# EAGLE schematic MOMO_2019 (EAGLE 7.3.0)

## Sheet 1 of 6
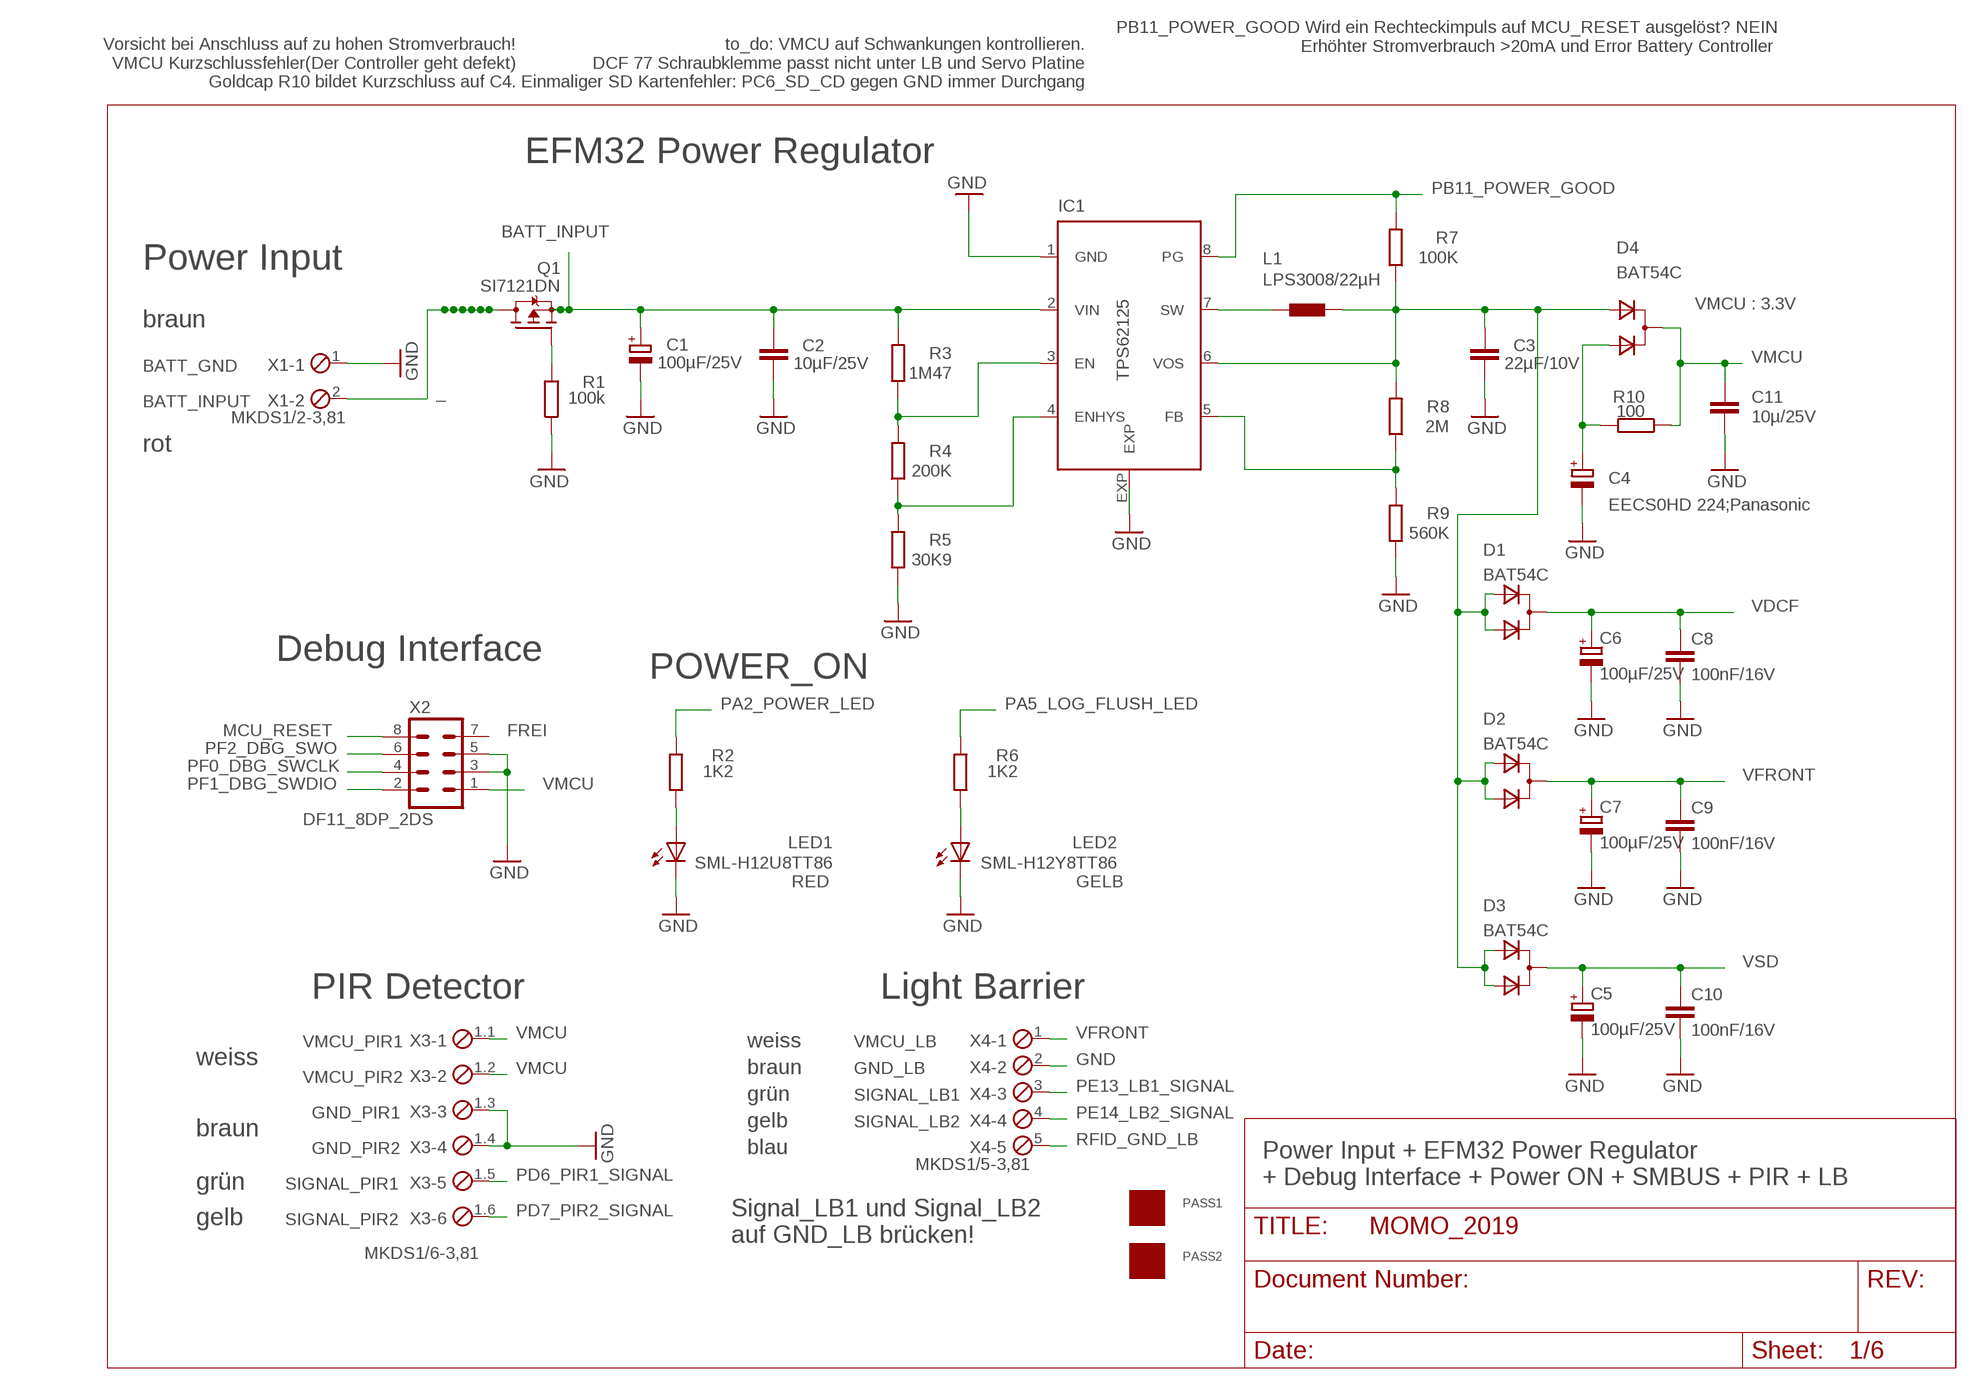
[diagram p0: schematic, sheet 1]

### Parts
C1  100µF/25V  CPOL-EUE  [PANASONIC_E]
C2  10µF/25V  C-EUC1206  [C1206]
C3  22µF/10V  C-EUC0603  [C0603]
C4  EECS0HD 224;Panasonic  GOLDCAPSPK-V  [GOLDCAPSPK-V]
C5  100µF/25V  CPOL-EUE  [PANASONIC_E]
C6  100µF/25V  CPOL-EUE  [PANASONIC_E]
C7  100µF/25V  CPOL-EUE  [PANASONIC_E]
C8  100nF/16V  C-EUC0805  [C0805]
C9  100nF/16V  C-EUC0805  [C0805]
C10  100nF/16V  C-EUC0805  [C0805]
C11  10µ/25V  C-EUC1206  [C1206]
D1  BAT54C  D2A_SOT23  [SOT-23$1]
D2  BAT54C  D2A_SOT23  [SOT-23$1]
D3  BAT54C  D2A_SOT23  [SOT-23$1]
D4  BAT54C  D2A_SOT23  [SOT-23$1]
IC1  TPS62125  [DSG_PWSO-N8_EXP]
L1  LPS3008/22µH  LPS3008  [LPS3008]
LED1  SML-H12U8TT86  LEDCHIPLED_0805  [CHIPLED_0805]
LED2  SML-H12Y8TT86  LEDCHIPLED_0805  [CHIPLED_0805]
PASS1  ROUND_1MM1.5  [ROUND2_1.5MM]
PASS2  ROUND_1MM1.5  [ROUND2_1.5MM]
Q1  SI7121DN  TRANSISTOR-FET_SI7113DN  [TRANSISTOR-FET_1212-8S]
R1  100k  R-EU_R0805  [R0805]
R2  1K2  R-EU_R0805  [R0805]
R3  1M47  R-EU_R0805  [R0805]
R4  200K  R-EU_R0805  [R0805]
R5  30K9  R-EU_R0805  [R0805]
R6  1K2  R-EU_R0805  [R0805]
R7  100K  R-EU_R0805  [R0805]
R8  2M  R-EU_R0805  [R0805]
R9  560K  R-EU_R0805  [R0805]
R10  100  R-EU_R0805  [R0805]
X1  MKDS1/2-3,81  [2POL381]
X2  DF11_8DP_2DS  DP11_8DP_2DS  [DP11_8DP-2DS]
X3  MKDS1/6-3,81  [6POL381]
X4  MKDS1/5-3,81  [5POL381]

### Nets
1: C3.1 D1.2(A1) D1.3(A2) D2.2(A1) D2.3(A2) D3.2(A1) D3.3(A2) D4.2(A1) IC1.6(VOS) L1.2 R7.1 R8.2
_: Q1.5(D) Q1.6(D) Q1.7(D) Q1.8(D) Q1.9(D) Q1.10(D) Q1.11(D) X1.2
BATT_INPUT: C1.+ C2.1 IC1.2(VIN) Q1.1(S) Q1.2(S) Q1.3(S) R3.2 ; also sheet 5,6
GND: C1.- C2.2 C3.2 C4.- C5.- C6.- C7.- C8.2 C9.2 C10.2 C11.1 IC1.1(GND) IC1.EXP LED1.C LED2.C R1.1 R5.1 R9.1 X1.1 X2.3 X2.5 X3.1.3 X3.1.4 X4.2 ; also sheet 2,3,4,5,6
MCU_RESET: X2.8 ; also sheet 2,3
N$2: LED2.A R6.2
N$3: C4.+ D4.3(A2) R10.2
N$5: IC1.3(EN) R3.1 R4.2
N$8: IC1.4(ENHYS) R4.1 R5.2
N$9: IC1.7(SW) L1.1
N$20: Q1.4(G) R1.2
N$29: LED1.A R2.2
N$46: IC1.5(FB) R8.1 R9.2
PA2_POWER_LED: R2.1 ; also sheet 2
PA5_LOG_FLUSH_LED: R6.1 ; also sheet 2
PB11_POWER_GOOD: IC1.8(PG) R7.2 ; also sheet 2
PD6_PIR1_SIGNAL: X3.1.5 ; also sheet 2
PD7_PIR2_SIGNAL: X3.1.6 ; also sheet 2
PE13_LB1_SIGNAL: X4.3 ; also sheet 2
PE14_LB2_SIGNAL: X4.4 ; also sheet 2
PF0_DBG_SWCLK: X2.4 ; also sheet 2
PF1_DBG_SWDIO: X2.2 ; also sheet 2
PF2_DBG_SWO: X2.6 ; also sheet 2
RFID_GND_LB: X4.5 ; also sheet 4
VDCF: C6.+ C8.1 D1.1(C) ; also sheet 3
VFRONT: C7.+ C9.1 D2.1(C) X4.1
VMCU: C11.2 D4.1(C) R10.1 X2.1 X3.1.1 X3.1.2 ; also sheet 2,3,4
VSD: C5.+ C10.1 D3.1(C) ; also sheet 3
Unconnected: X2.7

### Notes on the sheet
- PB11_POWER_GOOD Wird ein Rechteckimpuls auf MCU_RESET ausgelöst? NEIN
  Erhöhter Stromverbrauch >20mA und Error Battery Controller
- Vorsicht bei Anschluss auf zu hohen Stromverbrauch!
  VMCU Kurzschlussfehler(Der Controller geht defekt)
  Goldcap R10 bildet Kurzschluss auf C4.
- to_do: VMCU auf Schwankungen kontrollieren.
  DCF 77 Schraubklemme passt nicht unter LB und Servo Platine
  Einmaliger SD Kartenfehler: PC6_SD_CD gegen GND immer Durchgang
- EFM32 Power Regulator
- Power Input
- VMCU : 3.3V
- braun
- BATT_GND
- BATT_INPUT
- rot
- Debug Interface
- POWER_ON
- FREI
- RED | GELB
- PIR Detector | Light Barrier
- VMCU_PIR1 | weiss | VMCU_LB
- weiss
- braun | GND_LB
- VMCU_PIR2
- grün | SIGNAL_LB1
- GND_PIR1
- gelb | SIGNAL_LB2
- braun
- GND_PIR2 | blau
- Power Input + EFM32 Power Regulator 
  + Debug Interface + Power ON + SMBUS + PIR + LB
- grün | SIGNAL_PIR1
- gelb | SIGNAL_PIR2
- Signal_LB1 und Signal_LB2
  auf GND_LB brücken!

## Sheet 2 of 6
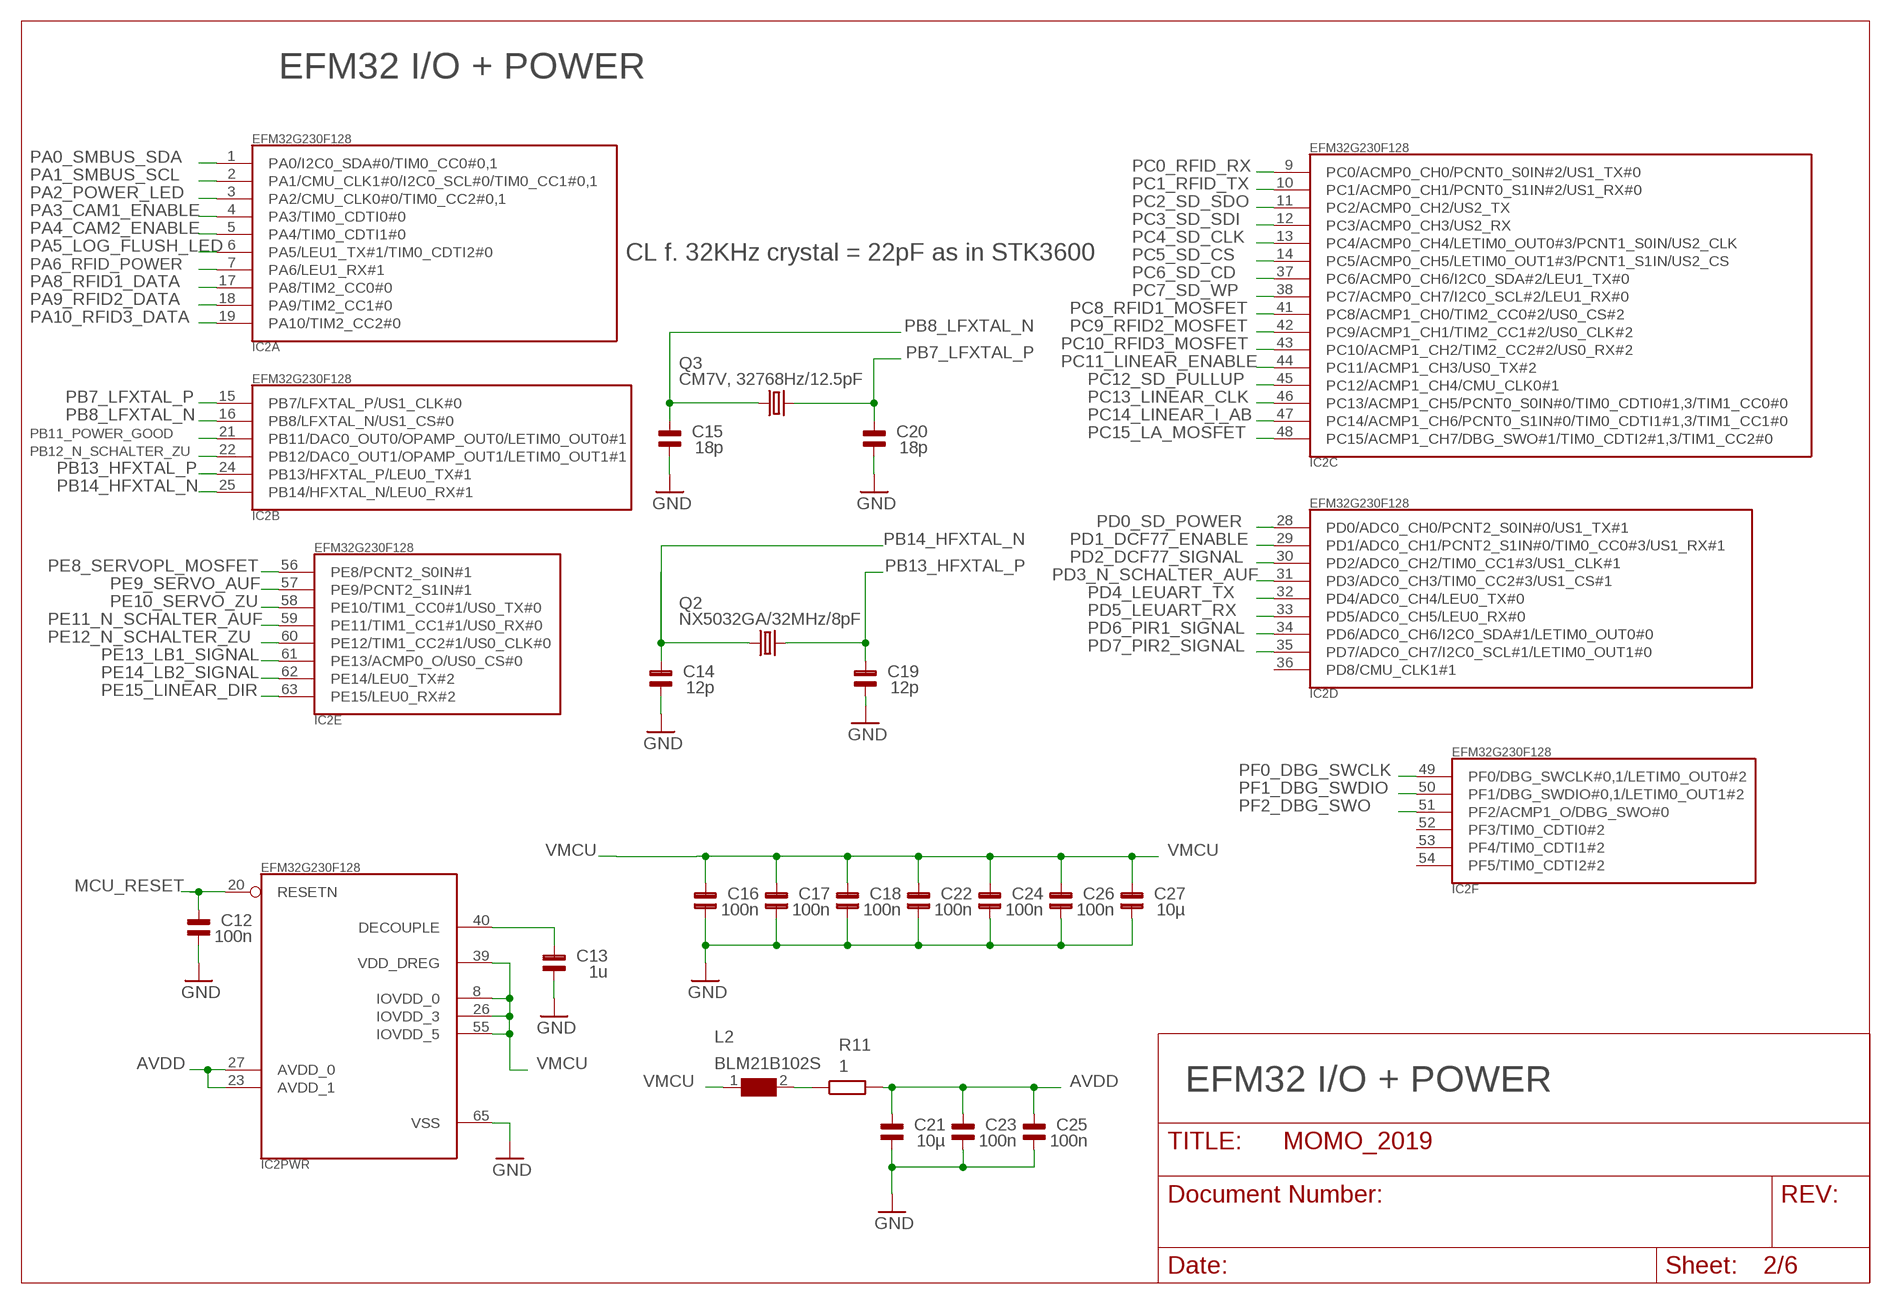
[diagram p1: schematic, sheet 2]

### Parts
C12  100n  C_SMD0805  [0805]
C13  1u  C_SMD0805  [0805]
C14  12p  C_SMD0805  [0805]
C15  18p  C_SMD0805  [0805]
C16  100n  C_SMD0805  [0805]
C17  100n  C_SMD0805  [0805]
C18  100n  C_SMD0805  [0805]
C19  12p  C_SMD0805  [0805]
C20  18p  C_SMD0805  [0805]
C21  10µ  C_SMD0805  [0805]
C22  100n  C_SMD0805  [0805]
C23  100n  C_SMD0805  [0805]
C24  100n  C_SMD0805  [0805]
C25  100n  C_SMD0805  [0805]
C26  100n  C_SMD0805  [0805]
C27  10µ  C_SMD0805  [0805]
IC2  EFM32G230F128  [QFN64]
L2  BLM21B102S  WE-CBF-7427920_0805  [0805]
Q2  NX5032GA/32MHz/8pF  CRYSTAL2P5.0X3.2  [CRYSTAL2P5.0X3.2]
Q3  CM7V, 32768Hz/12.5pF  CRYSTAL2P  [CRYSTAL2P3.2X1.5]
R11  1  R-EU_R0805  [R0805]

### Nets
AVDD [VCC]: C21.2 C23.2 C25.2 IC2.23(PWR:AVDD_1) IC2.27(PWR:AVDD_0) R11.2
GND: C12.1 C13.1 C14.1 C15.1 C16.1 C17.1 C18.1 C19.1 C20.1 C21.1 C22.1 C23.1 C24.1 C25.1 C26.1 C27.1 IC2.65(PWR:VSS) ; also sheet 1,3,4,5,6
MCU_RESET: C12.2 IC2.20(PWR:RESETN) ; also sheet 1,3
N$14: L2.2 R11.1
N$30: C13.2 IC2.40(PWR:DECOUPLE)
PA0_SMBUS_SDA: IC2.1(A:PA0/I2C0_SDA#0/TIM0_CC0#0,1) ; also sheet 3
PA1_SMBUS_SCL: IC2.2(A:PA1/CMU_CLK1#0/I2C0_SCL#0/TIM0_CC1#0,1) ; also sheet 3
PA2_POWER_LED: IC2.3(A:PA2/CMU_CLK0#0/TIM0_CC2#0,1) ; also sheet 1
PA3_CAM1_ENABLE: IC2.4(A:PA3/TIM0_CDTI0#0) ; also sheet 5
PA4_CAM2_ENABLE: IC2.5(A:PA4/TIM0_CDTI1#0) ; also sheet 5
PA5_LOG_FLUSH_LED: IC2.6(A:PA5/LEU1_TX#1/TIM0_CDTI2#0) ; also sheet 1
PA6_RFID_POWER: IC2.7(A:PA6/LEU1_RX#1) ; also sheet 4
PA8_RFID1_DATA: IC2.17(A:PA8/TIM2_CC0#0) ; also sheet 4
PA9_RFID2_DATA: IC2.18(A:PA9/TIM2_CC1#0) ; also sheet 4
PA10_RFID3_DATA: IC2.19(A:PA10/TIM2_CC2#0) ; also sheet 4
PB7_LFXTAL_P: C20.2 IC2.15(B:PB7/LFXTAL_P/US1_CLK#0) Q3.2
PB8_LFXTAL_N: C15.2 IC2.16(B:PB8/LFXTAL_N/US1_CS#0) Q3.1
PB11_POWER_GOOD: IC2.21(B:PB11/DAC0_OUT0/OPAMP_OUT0/LETIM0_OUT0#1) ; also sheet 1
PB12_N_SCHALTER_ZU: IC2.22(B:PB12/DAC0_OUT1/OPAMP_OUT1/LETIM0_OUT1#1) ; also sheet 6
PB13_HFXTAL_P: C19.2 IC2.24(B:PB13/HFXTAL_P/LEU0_TX#1) Q2.2
PB14_HFXTAL_N: C14.2 IC2.25(B:PB14/HFXTAL_N/LEU0_RX#1) Q2.1
PC0_RFID_RX: IC2.9(C:PC0/ACMP0_CH0/PCNT0_S0IN#2/US1_TX#0) ; also sheet 4
PC1_RFID_TX: IC2.10(C:PC1/ACMP0_CH1/PCNT0_S1IN#2/US1_RX#0) ; also sheet 4
PC2_SD_SDO: IC2.11(C:PC2/ACMP0_CH2/US2_TX) ; also sheet 3
PC3_SD_SDI: IC2.12(C:PC3/ACMP0_CH3/US2_RX) ; also sheet 3
PC4_SD_CLK: IC2.13(C:PC4/ACMP0_CH4/LETIM0_OUT0#3/PCNT1_S0IN/US2_CLK) ; also sheet 3
PC5_SD_CS: IC2.14(C:PC5/ACMP0_CH5/LETIM0_OUT1#3/PCNT1_S1IN/US2_CS) ; also sheet 3
PC6_SD_CD: IC2.37(C:PC6/ACMP0_CH6/I2C0_SDA#2/LEU1_TX#0) ; also sheet 3
PC7_SD_WP: IC2.38(C:PC7/ACMP0_CH7/I2C0_SCL#2/LEU1_RX#0) ; also sheet 3
PC8_RFID1_MOSFET: IC2.41(C:PC8/ACMP1_CH0/TIM2_CC0#2/US0_CS#2) ; also sheet 4
PC9_RFID2_MOSFET: IC2.42(C:PC9/ACMP1_CH1/TIM2_CC1#2/US0_CLK#2) ; also sheet 4
PC10_RFID3_MOSFET: IC2.43(C:PC10/ACMP1_CH2/TIM2_CC2#2/US0_RX#2) ; also sheet 4
PC11_LINEAR_ENABLE: IC2.44(C:PC11/ACMP1_CH3/US0_TX#2) ; also sheet 6
PC12_SD_PULLUP: IC2.45(C:PC12/ACMP1_CH4/CMU_CLK0#1) ; also sheet 3
PC13_LINEAR_CLK: IC2.46(C:PC13/ACMP1_CH5/PCNT0_S0IN#0/TIM0_CDTI0#1,3/TIM1_CC0#0) ; also sheet 6
PC14_LINEAR_I_AB: IC2.47(C:PC14/ACMP1_CH6/PCNT0_S1IN#0/TIM0_CDTI1#1,3/TIM1_CC1#0) ; also sheet 6
PC15_LA_MOSFET: IC2.48(C:PC15/ACMP1_CH7/DBG_SWO#1/TIM0_CDTI2#1,3/TIM1_CC2#0) ; also sheet 6
PD0_SD_POWER: IC2.28(D:PD0/ADC0_CH0/PCNT2_S0IN#0/US1_TX#1) ; also sheet 3
PD1_DCF77_ENABLE: IC2.29(D:PD1/ADC0_CH1/PCNT2_S1IN#0/TIM0_CC0#3/US1_RX#1) ; also sheet 3
PD2_DCF77_SIGNAL: IC2.30(D:PD2/ADC0_CH2/TIM0_CC1#3/US1_CLK#1) ; also sheet 3
PD3_N_SCHALTER_AUF: IC2.31(D:PD3/ADC0_CH3/TIM0_CC2#3/US1_CS#1) ; also sheet 6
PD4_LEUART_TX: IC2.32(D:PD4/ADC0_CH4/LEU0_TX#0) ; also sheet 3
PD5_LEUART_RX: IC2.33(D:PD5/ADC0_CH5/LEU0_RX#0) ; also sheet 3
PD6_PIR1_SIGNAL: IC2.34(D:PD6/ADC0_CH6/I2C0_SDA#1/LETIM0_OUT0#0) ; also sheet 1
PD7_PIR2_SIGNAL: IC2.35(D:PD7/ADC0_CH7/I2C0_SCL#1/LETIM0_OUT1#0) ; also sheet 1
PE8_SERVOPL_MOSFET: IC2.56(E:PE8/PCNT2_S0IN#1) ; also sheet 6
PE9_SERVO_AUF: IC2.57(E:PE9/PCNT2_S1IN#1) ; also sheet 6
PE10_SERVO_ZU: IC2.58(E:PE10/TIM1_CC0#1/US0_TX#0) ; also sheet 6
PE11_N_SCHALTER_AUF: IC2.59(E:PE11/TIM1_CC1#1/US0_RX#0) ; also sheet 6
PE12_N_SCHALTER_ZU: IC2.60(E:PE12/TIM1_CC2#1/US0_CLK#0) ; also sheet 6
PE13_LB1_SIGNAL: IC2.61(E:PE13/ACMP0_O/US0_CS#0) ; also sheet 1
PE14_LB2_SIGNAL: IC2.62(E:PE14/LEU0_TX#2) ; also sheet 1
PE15_LINEAR_DIR: IC2.63(E:PE15/LEU0_RX#2) ; also sheet 6
PF0_DBG_SWCLK: IC2.49(F:PF0/DBG_SWCLK#0,1/LETIM0_OUT0#2) ; also sheet 1
PF1_DBG_SWDIO: IC2.50(F:PF1/DBG_SWDIO#0,1/LETIM0_OUT1#2) ; also sheet 1
PF2_DBG_SWO: IC2.51(F:PF2/ACMP1_O/DBG_SWO#0) ; also sheet 1
VMCU: C16.2 C17.2 C18.2 C22.2 C24.2 C26.2 C27.2 IC2.8(PWR:IOVDD_0) IC2.26(PWR:IOVDD_3) IC2.39(PWR:VDD_DREG) IC2.55(PWR:IOVDD_5) L2.1 ; also sheet 1,3,4
Unconnected: IC2.36(D:PD8/CMU_CLK1#1) IC2.52(F:PF3/TIM0_CDTI0#2) IC2.53(F:PF4/TIM0_CDTI1#2) IC2.54(F:PF5/TIM0_CDTI2#2)

### Notes on the sheet
- EFM32 I/O + POWER
- CL f. 32KHz crystal = 22pF as in STK3600
- EFM32 I/O + POWER

## Sheet 3 of 6
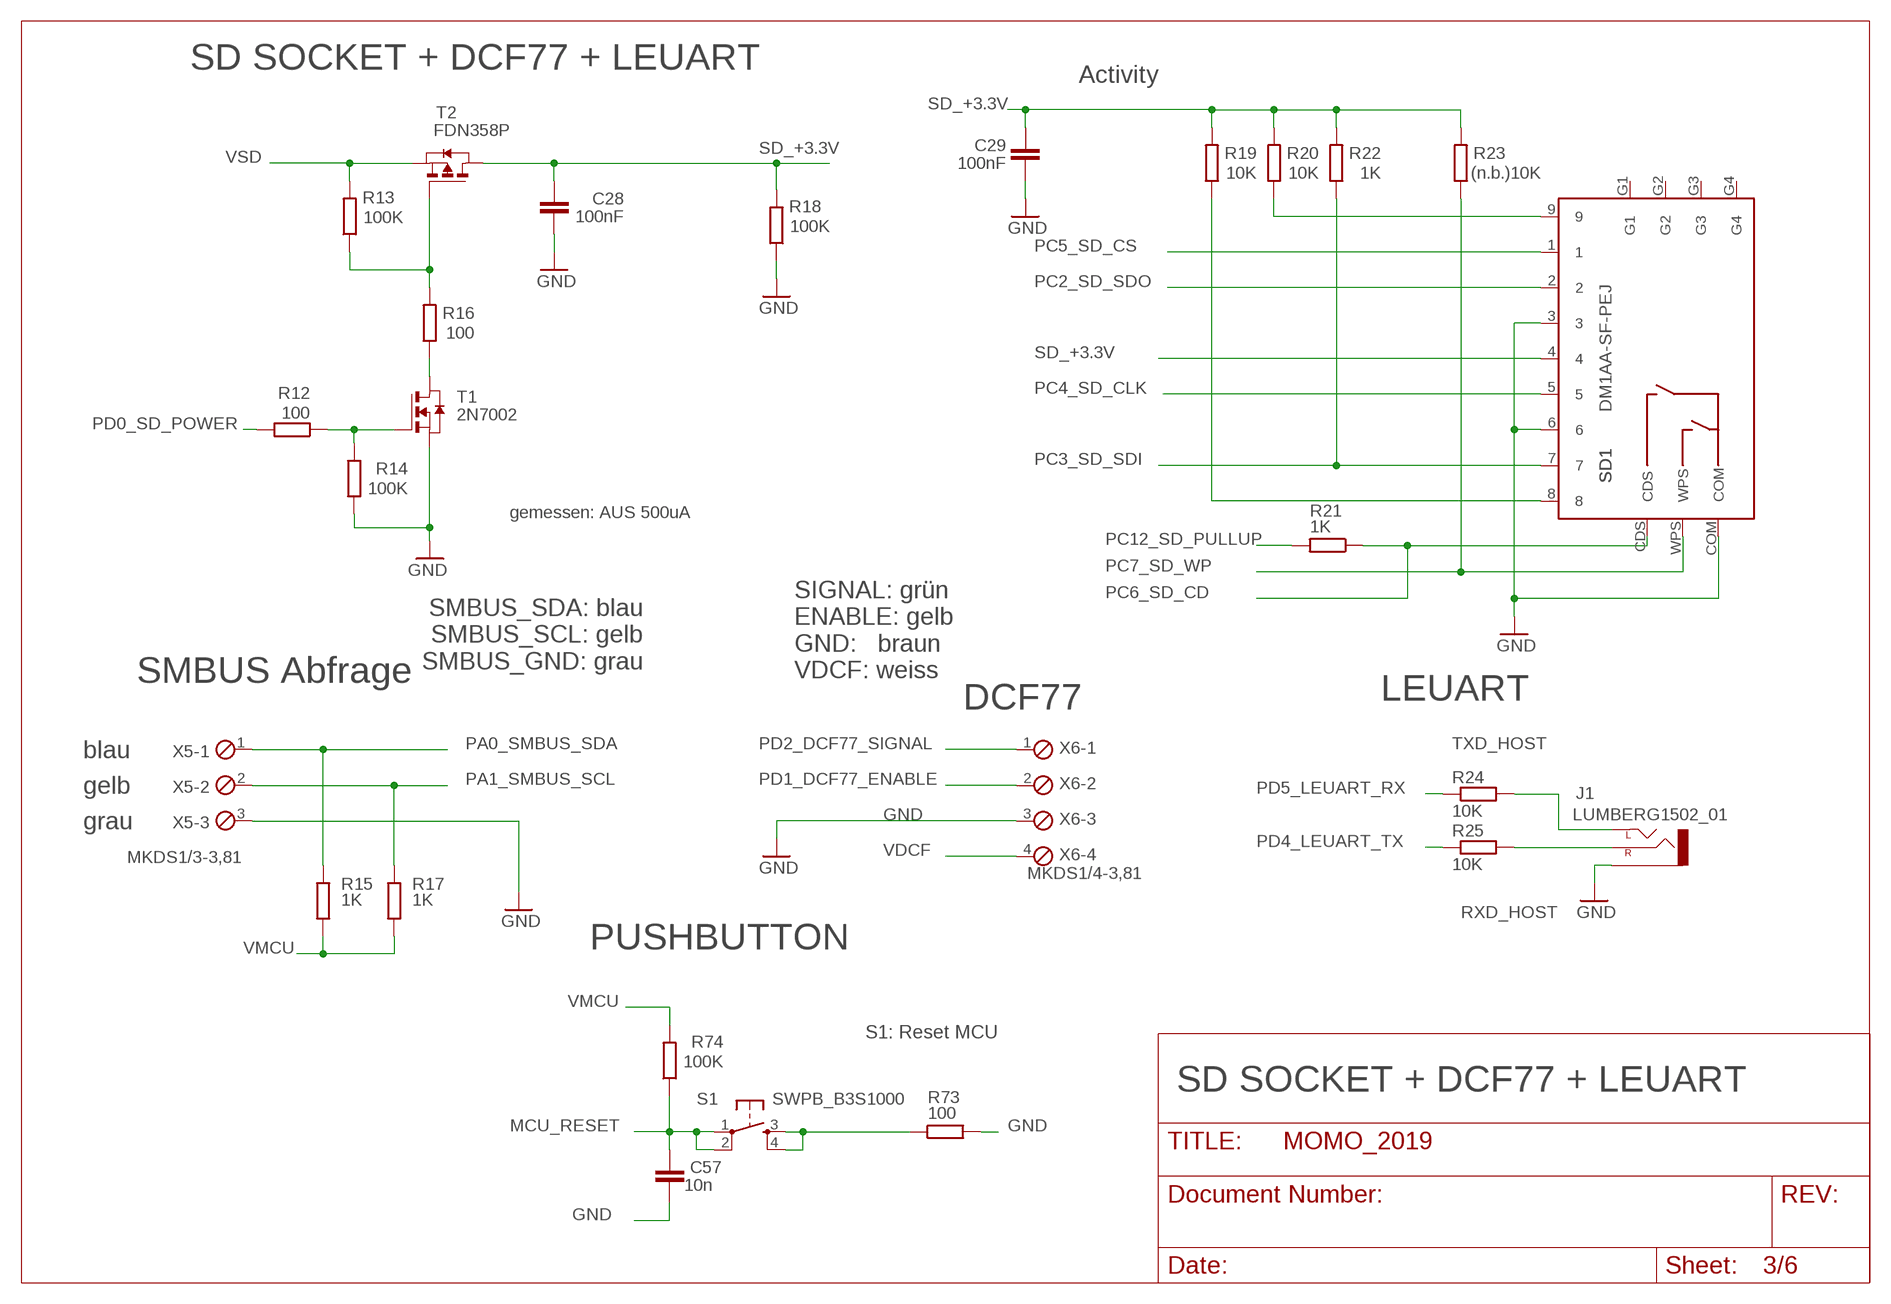
[diagram p2: schematic, sheet 3]

### Parts
C28  100nF  C-EUC0603  [C0603]
C29  100nF  C-EUC0603  [C0603]
C57  10n  C-EUC0603  [C0603]
J1  LUMBERG1502_01  [LUMBERG1502_01]
R12  100  R-EU_R0805  [R0805]
R13  100K  R-EU_R0805  [R0805]
R14  100K  R-EU_R0805  [R0805]
R15  1K  R-EU_R0805  [R0805]
R16  100  R-EU_R0805  [R0805]
R17  1K  R-EU_R0805  [R0805]
R18  100K  R-EU_R0805  [R0805]
R19  10K  R-EU_R0805  [R0805]
R20  10K  R-EU_R0805  [R0805]
R21  1K  R-EU_R0805  [R0805]
R22  1K  R-EU_R0805  [R0805]
R23  (n.b.)10K  R-EU_R0805  [R0805]
R24  10K  R-EU_R0805  [R0805]
R25  10K  R-EU_R0805  [R0805]
R73  100  R-EU_R0805  [R0805]
R74  100K  R-EU_R0805  [R0805]
S1  SWPB_B3S1000  DTSM-6  [DTSM-6]
SD1  DM1AA-SF-PEJ  [DM1AA-SF-PEJ]
T1  2N7002  ZETEX_NMOSSOT23  [ZETEX_SOT-23]
T2  FDN358P  ZETEX_PMOSSOT23  [ZETEX_SOT-23]
X5  MKDS1/3-3,81  [3POL381]
X6  MKDS1/4-3,81  [4POL381]

### Nets
GND: C28.2 C29.2 C57.1 J1.P$1(1-SLEEVE) R14.1 R18.1 R73.2 SD1.3 SD1.6 SD1.COM T1.2(S) X5.3 X6.3 ; also sheet 1,2,4,5,6
MCU_RESET: C57.2 R74.1 S1.1 S1.2 ; also sheet 1,2
N$15: R13.1 R16.2 T2.3(G)
N$16: R16.1 T1.1(D)
N$17: R12.1 R14.2 T1.3(G)
N$21: R20.1 SD1.9
N$22: R19.1 SD1.8
N$43: R73.1 S1.3 S1.4
PA0_SMBUS_SDA: R15.1 X5.1 ; also sheet 2
PA1_SMBUS_SCL: R17.1 X5.2 ; also sheet 2
PC2_SD_SDO: SD1.2 ; also sheet 2
PC3_SD_SDI: R22.1 SD1.7 ; also sheet 2
PC4_SD_CLK: SD1.5 ; also sheet 2
PC5_SD_CS: SD1.1 ; also sheet 2
PC6_SD_CD: R21.1 SD1.CDS ; also sheet 2
PC7_SD_WP: R23.1 SD1.WPS ; also sheet 2
PC12_SD_PULLUP: R21.2 ; also sheet 2
PD0_SD_POWER: R12.2 ; also sheet 2
PD1_DCF77_ENABLE: X6.2 ; also sheet 2
PD2_DCF77_SIGNAL: X6.1 ; also sheet 2
PD4_LEUART_TX: R25.1 ; also sheet 2
PD5_LEUART_RX: R24.1 ; also sheet 2
RXD_HOST: J1.P$3(3-RIGHT) R25.2
SD_+3.3V: C28.1 C29.1 R18.2 R19.2 R20.2 R22.2 R23.2 SD1.4 T2.1(D)
TXD_HOST: J1.P$2(2-LEFT) R24.2
VDCF: X6.4 ; also sheet 1
VMCU: R15.2 R17.2 R74.2 ; also sheet 1,2,4
VSD: R13.2 T2.2(S) ; also sheet 1
Unconnected: SD1.G1 SD1.G2 SD1.G3 SD1.G4

### Notes on the sheet
- SD SOCKET + DCF77 + LEUART
- Activity
- gemessen: AUS 500uA
- SMBUS_SDA: blau
  SMBUS_SCL: gelb
  SMBUS_GND: grau
- SIGNAL: grün
  ENABLE: gelb
  GND:   braun
  VDCF: weiss
- SMBUS Abfrage
- DCF77 | LEUART
- blau
- gelb
- grau
- PUSHBUTTON
- S1: Reset MCU
- SD SOCKET + DCF77 + LEUART

## Sheet 4 of 6
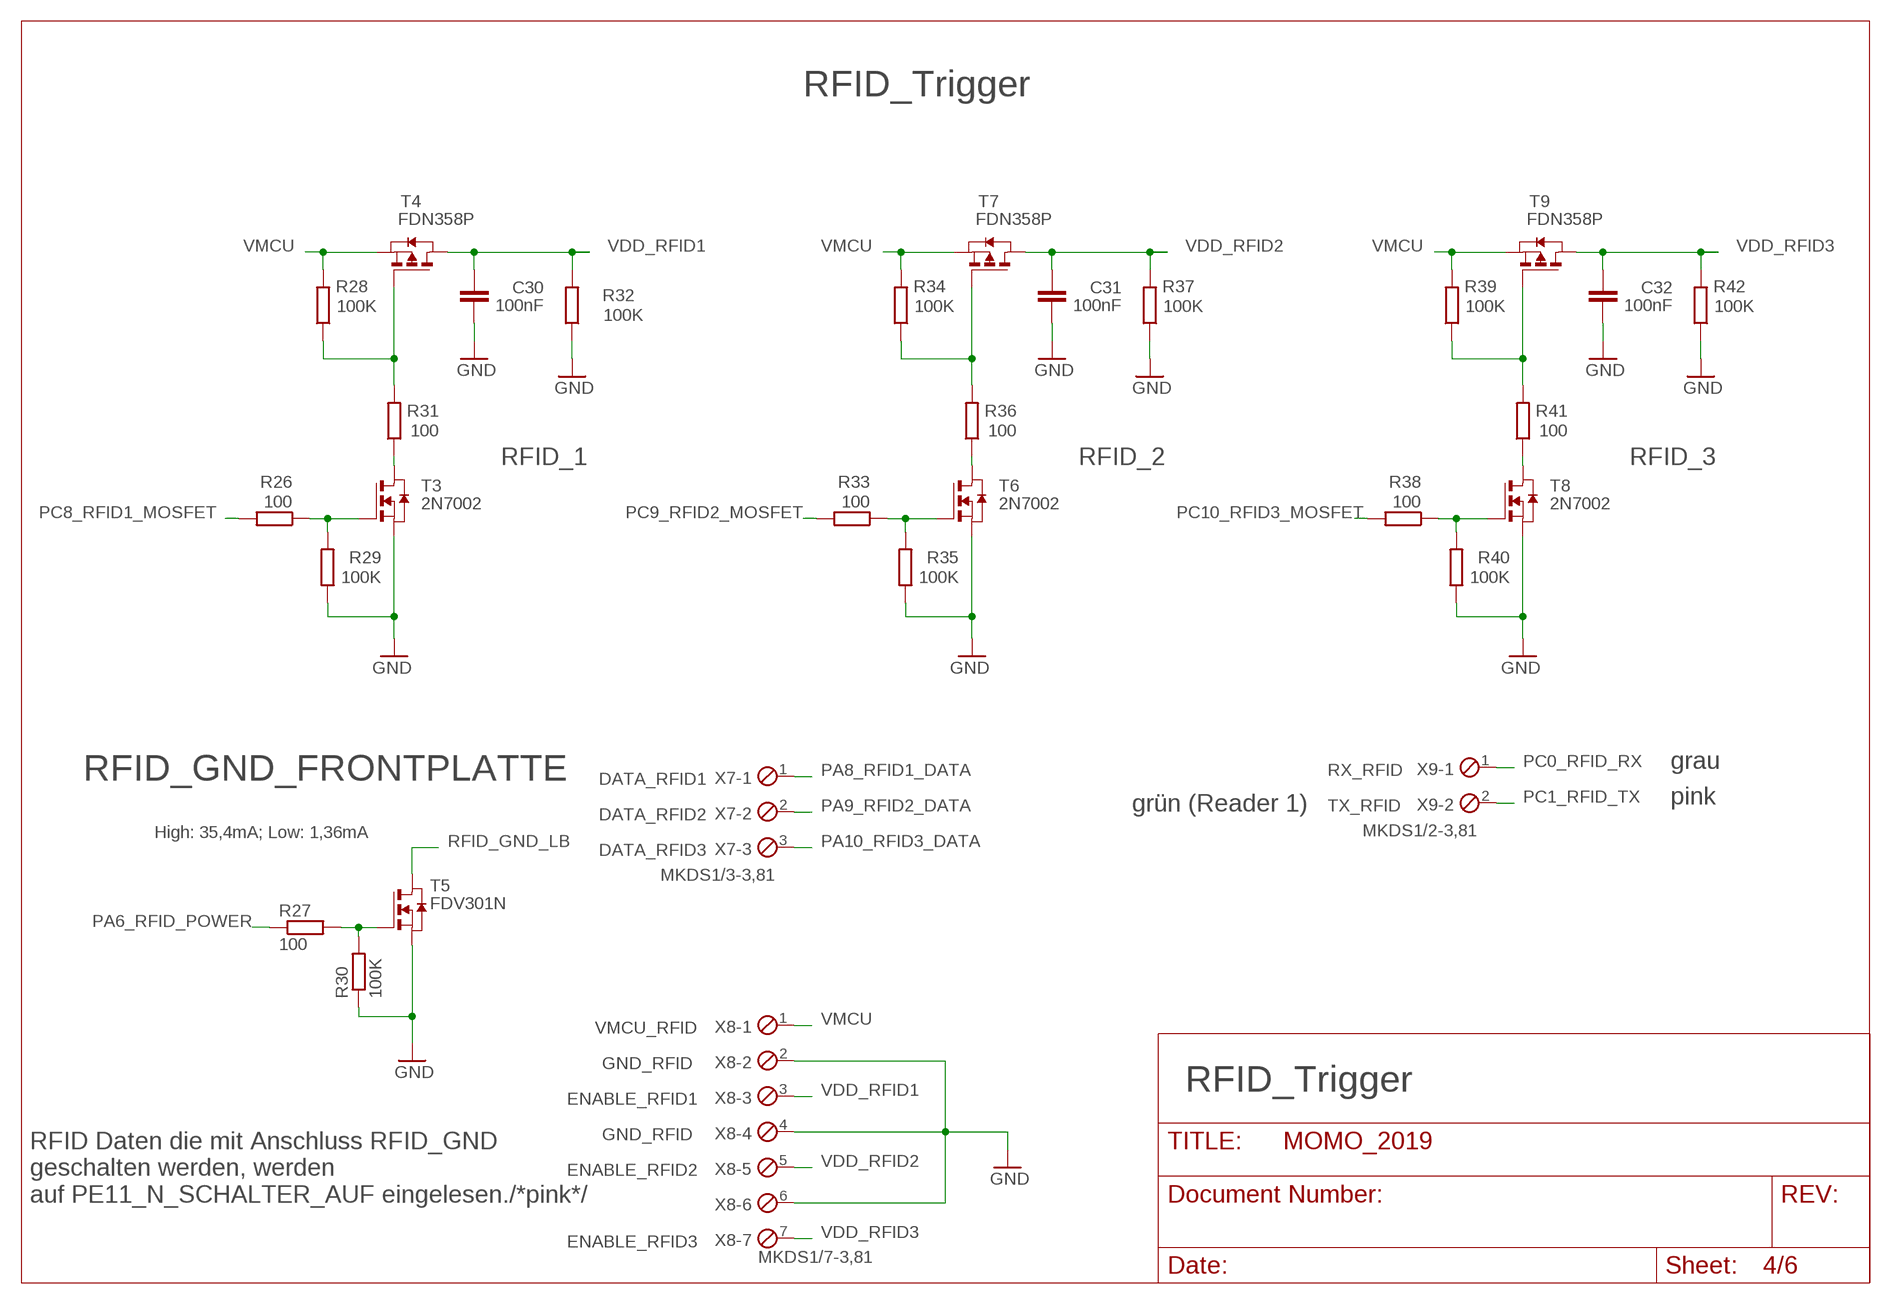
[diagram p3: schematic, sheet 4]

### Parts
C30  100nF  C-EUC0603  [C0603]
C31  100nF  C-EUC0603  [C0603]
C32  100nF  C-EUC0603  [C0603]
R26  100  R-EU_R0805  [R0805]
R27  100  R-EU_R0805  [R0805]
R28  100K  R-EU_R0805  [R0805]
R29  100K  R-EU_R0805  [R0805]
R30  100K  R-EU_R0805  [R0805]
R31  100  R-EU_R0805  [R0805]
R32  100K  R-EU_R0805  [R0805]
R33  100  R-EU_R0805  [R0805]
R34  100K  R-EU_R0805  [R0805]
R35  100K  R-EU_R0805  [R0805]
R36  100  R-EU_R0805  [R0805]
R37  100K  R-EU_R0805  [R0805]
R38  100  R-EU_R0805  [R0805]
R39  100K  R-EU_R0805  [R0805]
R40  100K  R-EU_R0805  [R0805]
R41  100  R-EU_R0805  [R0805]
R42  100K  R-EU_R0805  [R0805]
T3  2N7002  ZETEX_NMOSSOT23  [ZETEX_SOT-23]
T4  FDN358P  ZETEX_PMOSSOT23  [ZETEX_SOT-23]
T5  FDV301N  NMOSSOT23  [SOT-23]
T6  2N7002  ZETEX_NMOSSOT23  [ZETEX_SOT-23]
T7  FDN358P  ZETEX_PMOSSOT23  [ZETEX_SOT-23]
T8  2N7002  ZETEX_NMOSSOT23  [ZETEX_SOT-23]
T9  FDN358P  ZETEX_PMOSSOT23  [ZETEX_SOT-23]
X7  MKDS1/3-3,81  [3POL381]
X8  MKDS1/7-3,81  [7POL381]
X9  MKDS1/2-3,81  [2POL381]

### Nets
GND: C30.2 C31.2 C32.2 R29.1 R30.1 R32.1 R35.1 R37.1 R40.1 R42.1 T3.2(S) T5.2(S) T6.2(S) T8.2(S) X8.2 X8.4 X8.6 ; also sheet 1,2,3,5,6
N$4: R28.1 R31.2 T4.3(G)
N$6: R31.1 T3.1(D)
N$7: R26.1 R29.2 T3.3(G)
N$10: R39.1 R41.2 T9.3(G)
N$11: R41.1 T8.1(D)
N$12: R27.2 R30.2 T5.3(G)
N$13: R38.1 R40.2 T8.3(G)
N$36: R34.1 R36.2 T7.3(G)
N$38: R36.1 T6.1(D)
N$42: R33.1 R35.2 T6.3(G)
PA6_RFID_POWER: R27.1 ; also sheet 2
PA8_RFID1_DATA: X7.1 ; also sheet 2
PA9_RFID2_DATA: X7.2 ; also sheet 2
PA10_RFID3_DATA: X7.3 ; also sheet 2
PC0_RFID_RX: X9.1 ; also sheet 2
PC1_RFID_TX: X9.2 ; also sheet 2
PC8_RFID1_MOSFET: R26.2 ; also sheet 2
PC9_RFID2_MOSFET: R33.2 ; also sheet 2
PC10_RFID3_MOSFET: R38.2 ; also sheet 2
RFID_GND_LB: T5.1(D) ; also sheet 1
VDD_RFID1: C30.1 R32.2 T4.1(D) X8.3
VDD_RFID2: C31.1 R37.2 T7.1(D) X8.5
VDD_RFID3: C32.1 R42.2 T9.1(D) X8.7
VMCU: R28.2 R34.2 R39.2 T4.2(S) T7.2(S) T9.2(S) X8.1 ; also sheet 1,2,3

### Notes on the sheet
- RFID_Trigger
- RFID_1 | RFID_2 | RFID_3
- grau
- RFID_GND_FRONTPLATTE | RX_RFID
- DATA_RFID1
- grün (Reader 1) | pink
- TX_RFID
- DATA_RFID2
- High: 35,4mA; Low: 1,36mA
- DATA_RFID3
- VMCU_RFID
- GND_RFID
- RFID_Trigger
- ENABLE_RFID1
- GND_RFID
- ENABLE_RFID2
- RFID Daten die mit Anschluss RFID_GND 
  geschalten werden, werden
  auf PE11_N_SCHALTER_AUF eingelesen./*pink*/
- ENABLE_RFID3

## Sheet 5 of 6
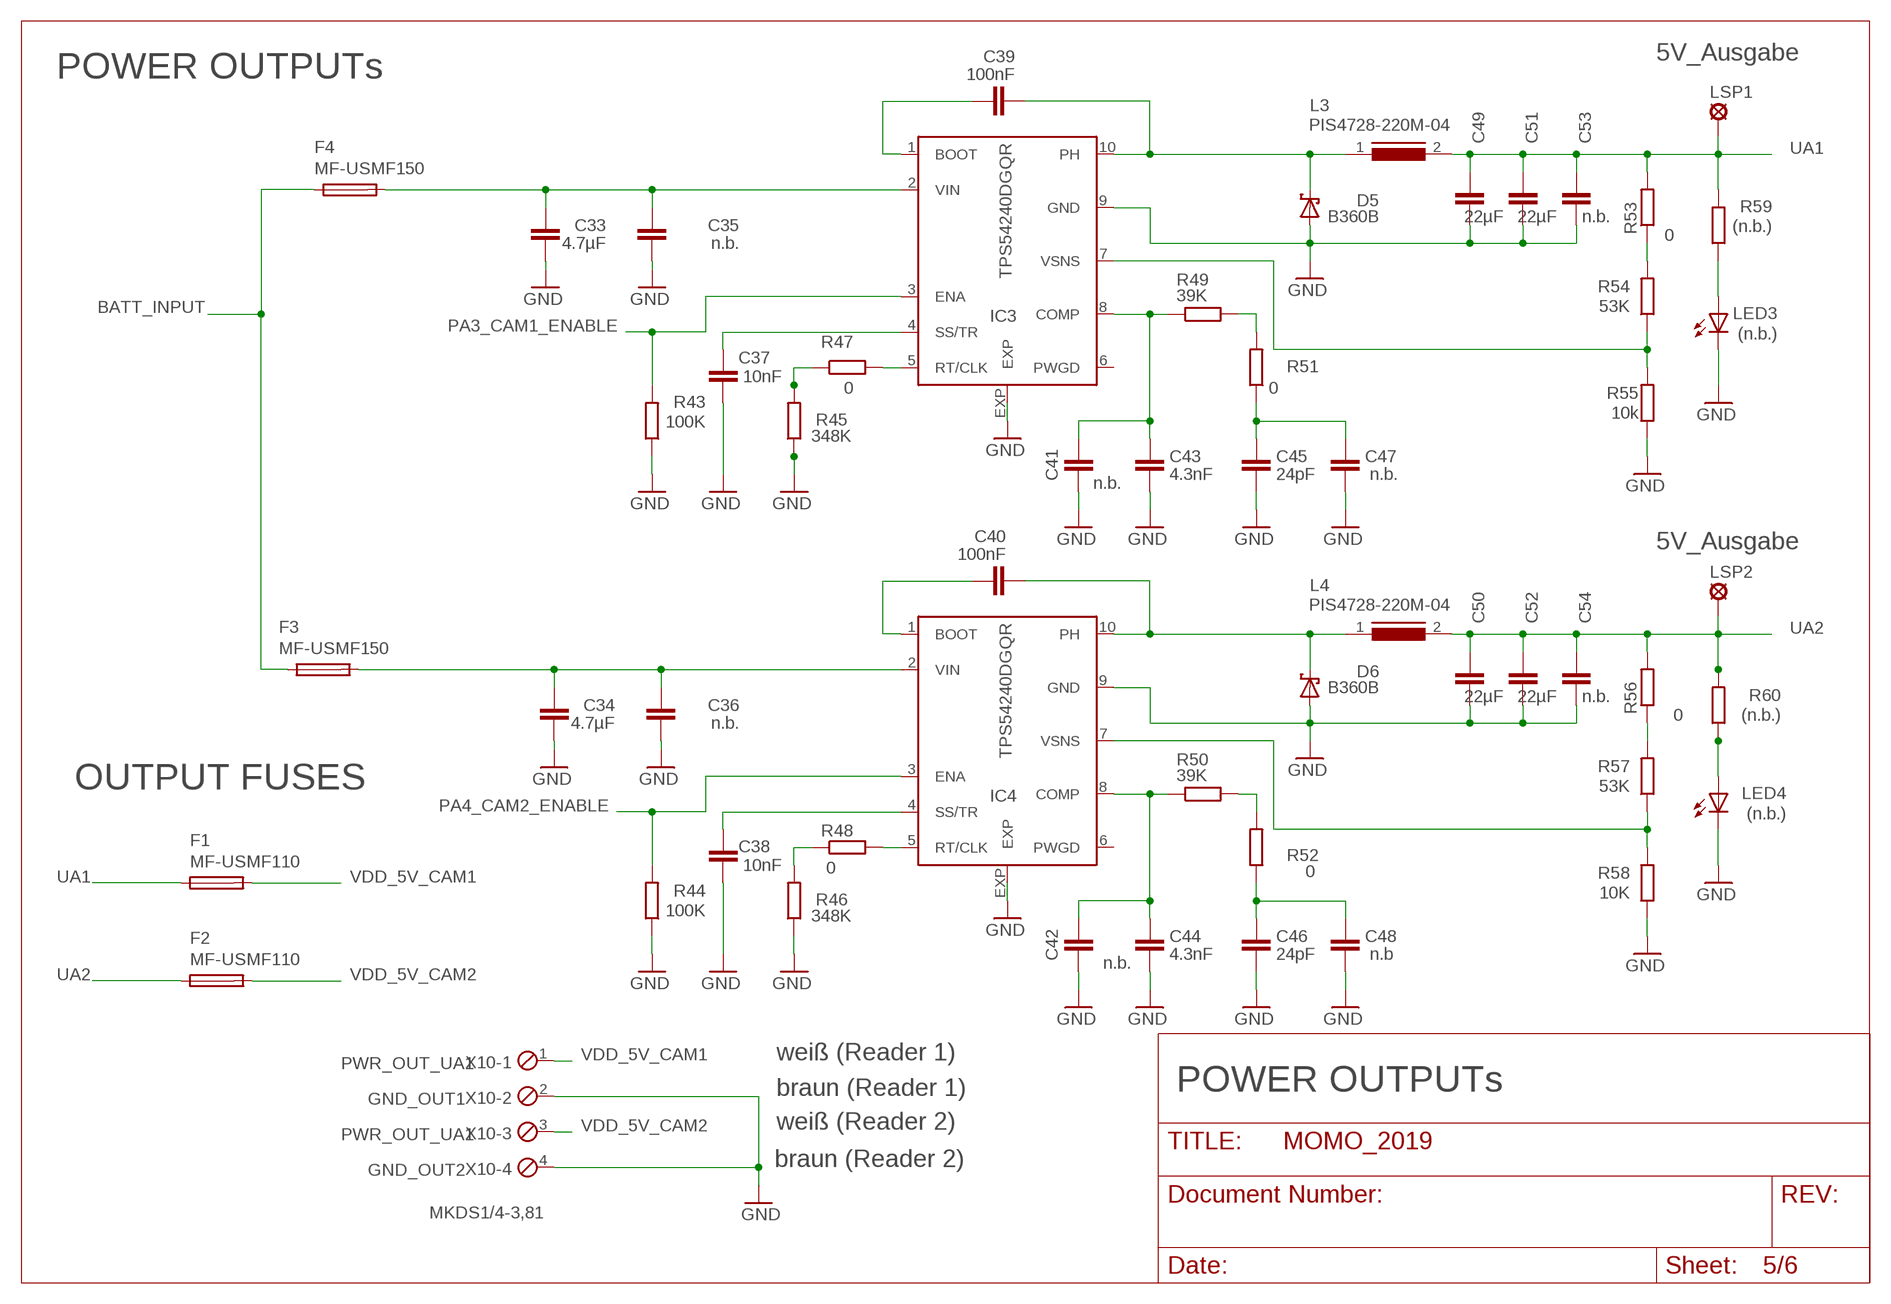
[diagram p4: schematic, sheet 5]

### Parts
C33  4.7µF  C-EUC1210  [C1210]
C34  4.7µF  C-EUC1210  [C1210]
C35  n.b.  C-EUC1210  [C1210]
C36  n.b.  C-EUC1210  [C1210]
C37  10nF  C-EUC0603  [C0603]
C38  10nF  C-EUC0603  [C0603]
C39  100nF  C-EUC0603  [C0603]
C40  100nF  C-EUC0603  [C0603]
C41  n.b.  C-EUC0603  [C0603]
C42  n.b.  C-EUC0603  [C0603]
C43  4.3nF  C-EUC0603  [C0603]
C44  4.3nF  C-EUC0603  [C0603]
C45  24pF  C-EUC0603  [C0603]
C46  24pF  C-EUC0603  [C0603]
C47  n.b.  C-EUC0603  [C0603]
C48  n.b  C-EUC0603  [C0603]
C49  22µF  C-EUC1210  [C1210]
C50  22µF  C-EUC1210  [C1210]
C51  22µF  C-EUC1210  [C1210]
C52  22µF  C-EUC1210  [C1210]
C53  n.b.  C-EUC1210  [C1210]
C54  n.b.  C-EUC1210  [C1210]
D5  B360B  SCHOTTKY-DIODESMD  [SMB]
D6  B360B  SCHOTTKY-DIODESMD  [SMB]
F1  MF-USMF110  PFUF  [PFUF_1210POLY]
F2  MF-USMF110  PFUF  [PFUF_1210POLY]
F3  MF-USMF150  PFUF  [PFUF_1210POLY]
F4  MF-USMF150  PFUF  [PFUF_1210POLY]
IC3  TPS54240DGQR  [S-PDSO-G10]
IC4  TPS54240DGQR  [S-PDSO-G10]
L3  PIS4728-220M-04  DR127  [DR127]
L4  PIS4728-220M-04  DR127  [DR127]
LED3  (n.b.)  LEDCHIPLED_0805  [CHIPLED_0805]
LED4  (n.b.)  LEDCHIPLED_0805  [CHIPLED_0805]
LSP1  (n.b.)SE13  SE13  [SE13]
LSP2  (n.b.)SE13  SE13  [SE13]
R43  100K  R-EU_R0805  [R0805]
R44  100K  R-EU_R0805  [R0805]
R45  348K  R-EU_R0805  [R0805]
R46  348K  R-EU_R0805  [R0805]
R47  0  R-EU_R0805  [R0805]
R48  0  R-EU_R0805  [R0805]
R49  39K  R-EU_R0805  [R0805]
R50  39K  R-EU_R0805  [R0805]
R51  0  R-EU_R0805  [R0805]
R52  0  R-EU_R0805  [R0805]
R53  0  R-EU_R0805  [R0805]
R54  53K  R-EU_R0805  [R0805]
R55  10k  R-EU_R0805  [R0805]
R56  0  R-EU_R0805  [R0805]
R57  53K  R-EU_R0805  [R0805]
R58  10K  R-EU_R0805  [R0805]
R59  (n.b.)  R-EU_R0805  [R0805]
R60  (n.b.)  R-EU_R0805  [R0805]
X10  MKDS1/4-3,81  [4POL381]

### Nets
BATT_INPUT: F3.P$1 F4.P$1 ; also sheet 1,6
GND: C33.2 C34.2 C35.2 C36.2 C37.2 C38.2 C41.2 C42.2 C43.2 C44.2 C45.2 C46.2 C47.2 C48.2 C49.2 C50.2 C51.2 C52.2 C53.2 C54.2 D5.A D6.A IC3.9(GND) IC3.EXP IC4.9(GND) IC4.EXP LED3.C LED4.C R43.1 R44.1 R45.1 R46.1 R55.1 R58.1 X10.2 X10.4 ; also sheet 1,2,3,4,6
N$19: C39.2 IC3.1(BOOT)
N$26: C39.1 D5.C IC3.10(PH) L3.1
N$27: C37.1 IC3.4(SS/TR)
N$28: C41.1 C43.1 IC3.8(COMP) R49.1
N$31: C45.1 C47.1 R51.1
N$32: IC3.7(VSNS) R54.1 R55.2
N$33: C40.2 IC4.1(BOOT)
N$34: C40.1 D6.C IC4.10(PH) L4.1
N$35: C38.1 IC4.4(SS/TR)
N$37: C42.1 C44.1 IC4.8(COMP) R50.1
N$39: C46.1 C48.1 R52.1
N$40: IC4.7(VSNS) R57.1 R58.2
N$41: LED4.A R60.1
N$44: R45.2 R47.1
N$47: R46.2 R48.1
N$48: IC3.5(RT/CLK) R47.2
N$49: R49.2 R51.2
N$50: R53.1 R54.2
N$51: IC4.5(RT/CLK) R48.2
N$52: R56.1 R57.2
N$53: R50.2 R52.2
N$54: LED3.A R59.1
N$71: C33.1 C35.1 F4.P$2 IC3.2(VIN)
N$72: C34.1 C36.1 F3.P$2 IC4.2(VIN)
PA3_CAM1_ENABLE: IC3.3(ENA) R43.2 ; also sheet 2
PA4_CAM2_ENABLE: IC4.3(ENA) R44.2 ; also sheet 2
UA1: C49.1 C51.1 C53.1 F1.P$1 L3.2 LSP1.MP R53.2 R59.2
UA2: C50.1 C52.1 C54.1 F2.P$1 L4.2 LSP2.MP R56.2 R60.2
VDD_5V_CAM1: F1.P$2 X10.1
VDD_5V_CAM2: F2.P$2 X10.3
Unconnected: IC3.6(PWGD) IC4.6(PWGD)

### Notes on the sheet
- 5V_Ausgabe
- POWER OUTPUTs
- 5V_Ausgabe
- OUTPUT FUSES
- weiß (Reader 1)
- PWR_OUT_UA1
- braun (Reader 1) | POWER OUTPUTs
- GND_OUT1
- weiß (Reader 2)
- PWR_OUT_UA1
- braun (Reader 2)
- GND_OUT2

## Sheet 6 of 6
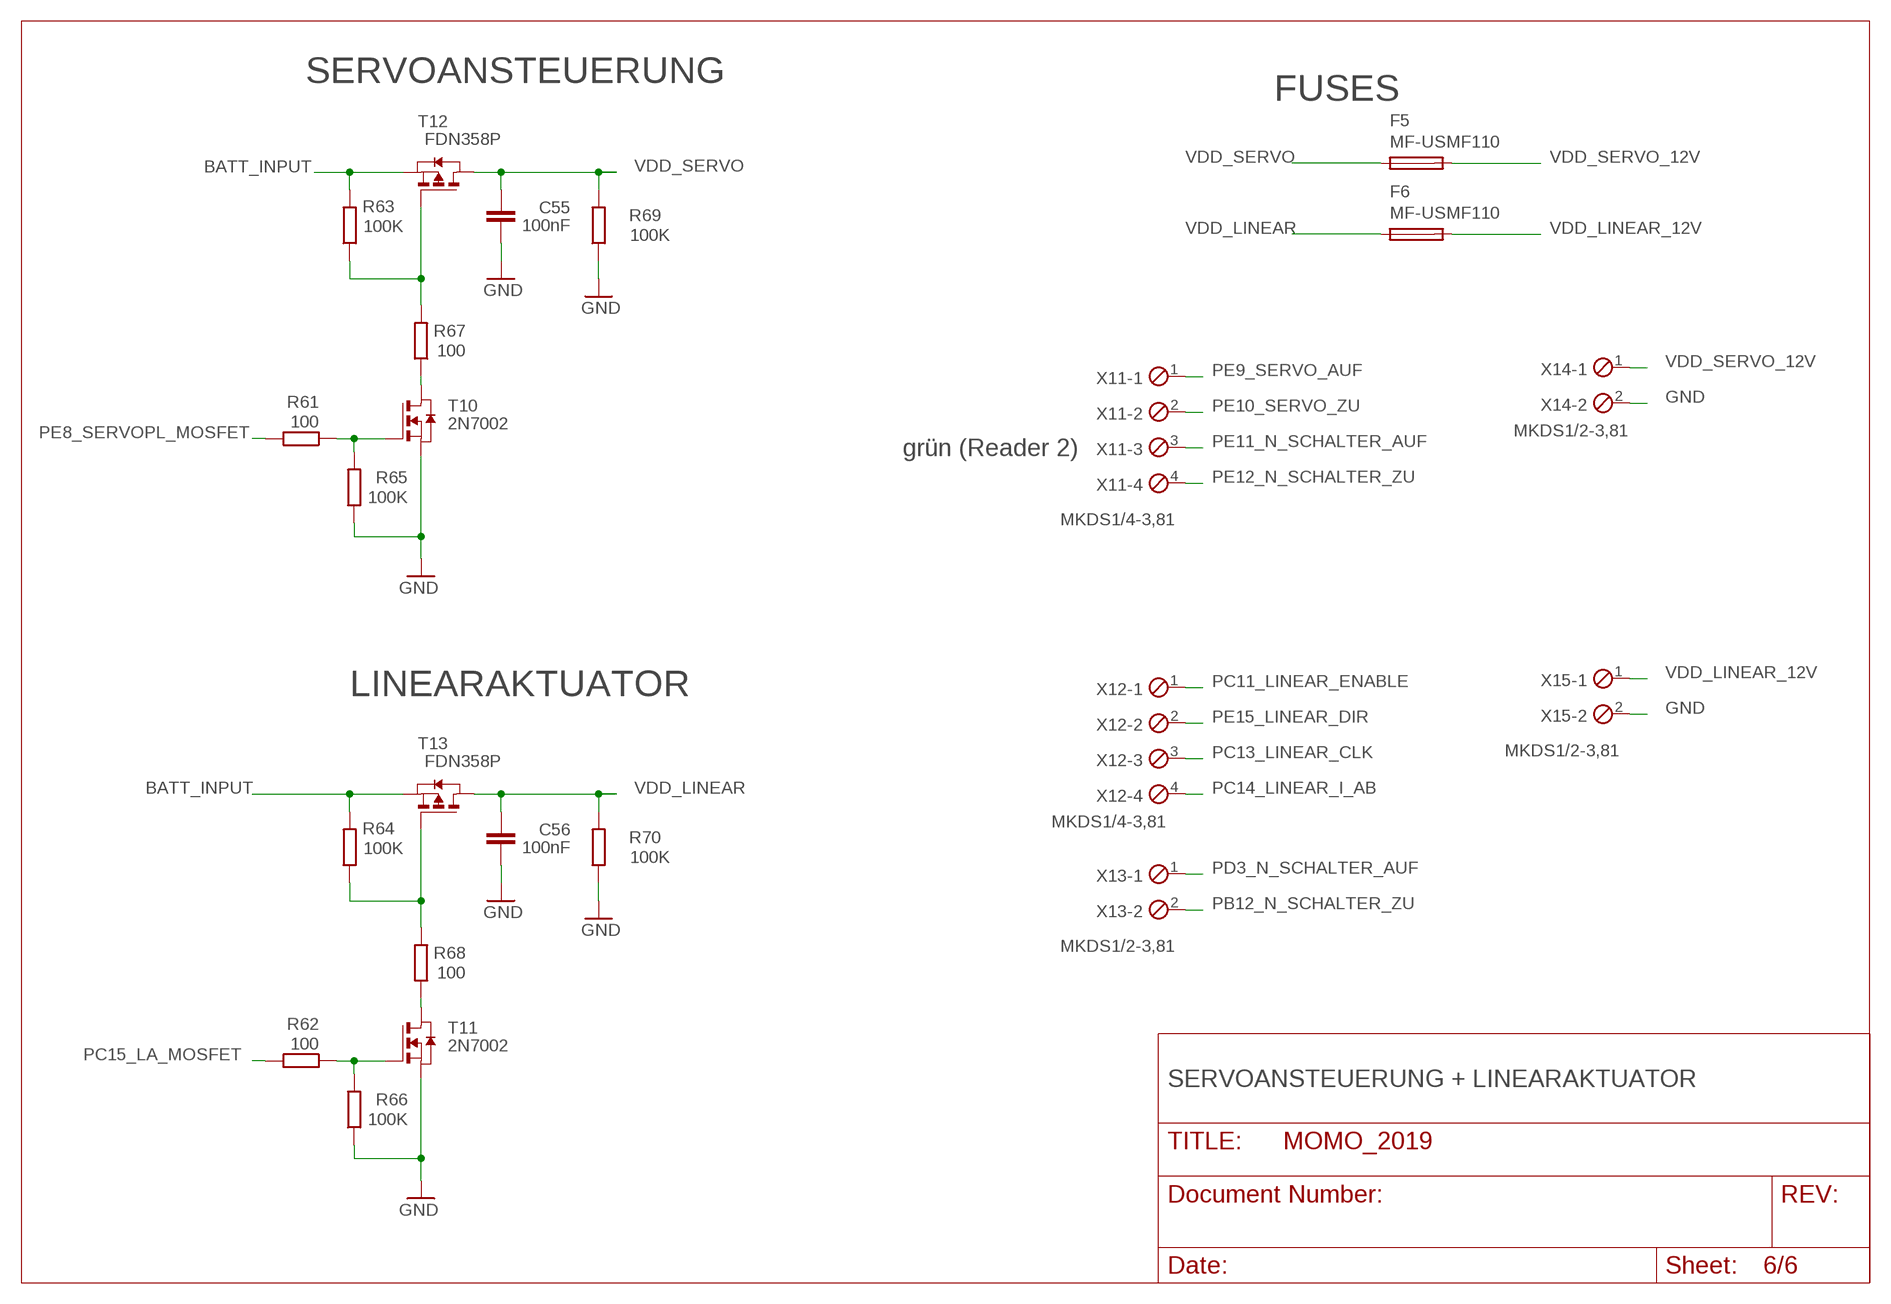
[diagram p5: schematic, sheet 6]

### Parts
C55  100nF  C-EUC0603  [C0603]
C56  100nF  C-EUC0603  [C0603]
F5  MF-USMF110  PFUF  [PFUF_1210POLY]
F6  MF-USMF110  PFUF  [PFUF_1210POLY]
R61  100  R-EU_R0805  [R0805]
R62  100  R-EU_R0805  [R0805]
R63  100K  R-EU_R0805  [R0805]
R64  100K  R-EU_R0805  [R0805]
R65  100K  R-EU_R0805  [R0805]
R66  100K  R-EU_R0805  [R0805]
R67  100  R-EU_R0805  [R0805]
R68  100  R-EU_R0805  [R0805]
R69  100K  R-EU_R0805  [R0805]
R70  100K  R-EU_R0805  [R0805]
T10  2N7002  ZETEX_NMOSSOT23  [ZETEX_SOT-23]
T11  2N7002  ZETEX_NMOSSOT23  [ZETEX_SOT-23]
T12  FDN358P  ZETEX_PMOSSOT23  [ZETEX_SOT-23]
T13  FDN358P  ZETEX_PMOSSOT23  [ZETEX_SOT-23]
X11  MKDS1/4-3,81  [4POL381]
X12  MKDS1/4-3,81  [4POL381]
X13  MKDS1/2-3,81  [2POL381]
X14  MKDS1/2-3,81  [2POL381]
X15  MKDS1/2-3,81  [2POL381]

### Nets
BATT_INPUT: R63.2 R64.2 T12.2(S) T13.2(S) ; also sheet 1,5
GND: C55.2 C56.2 R65.1 R66.1 R69.1 R70.1 T10.2(S) T11.2(S) X14.2 X15.2 ; also sheet 1,2,3,4,5
N$24: R63.1 R67.2 T12.3(G)
N$25: R67.1 T10.1(D)
N$45: R61.1 R65.2 T10.3(G)
N$55: R64.1 R68.2 T13.3(G)
N$56: R68.1 T11.1(D)
N$57: R62.1 R66.2 T11.3(G)
PB12_N_SCHALTER_ZU: X13.2 ; also sheet 2
PC11_LINEAR_ENABLE: X12.1 ; also sheet 2
PC13_LINEAR_CLK: X12.3 ; also sheet 2
PC14_LINEAR_I_AB: X12.4 ; also sheet 2
PC15_LA_MOSFET: R62.2 ; also sheet 2
PD3_N_SCHALTER_AUF: X13.1 ; also sheet 2
PE8_SERVOPL_MOSFET: R61.2 ; also sheet 2
PE9_SERVO_AUF: X11.1 ; also sheet 2
PE10_SERVO_ZU: X11.2 ; also sheet 2
PE11_N_SCHALTER_AUF: X11.3 ; also sheet 2
PE12_N_SCHALTER_ZU: X11.4 ; also sheet 2
PE15_LINEAR_DIR: X12.2 ; also sheet 2
VDD_LINEAR: C56.1 F6.P$1 R70.2 T13.1(D)
VDD_LINEAR_12V: F6.P$2 X15.1
VDD_SERVO: C55.1 F5.P$1 R69.2 T12.1(D)
VDD_SERVO_12V: F5.P$2 X14.1

### Notes on the sheet
- SERVOANSTEUERUNG
- FUSES
- grün (Reader 2)
- LINEARAKTUATOR
- SERVOANSTEUERUNG + LINEARAKTUATOR

## Library data of the parts
C1 C5-C7 = resistor:CPOL-EU: POLARIZED CAPACITOR, European symbol
C2 C3 C8-C11 C33-C54 = rcl:C-EU: CAPACITOR, European symbol
C4 = EdM 2011:GOLDCAP
C12-C27 = IAR.RLC:C_SMD
C28-C32 C55-C57 = resistor:C-EU: CAPACITOR, European symbol
D1-D4 = zetex:D2A_SOT23: Dual DIODE
D5 D6 = diode:SCHOTTKY-DIODE: Schottky Diode
F1-F6 = fuse:PFUF
IC1 = texas_Kiermaier:TPS62125
IC2 = EnergyMicro:EFM32G230F128: EFM32G230F128 Gecko Microcontroller in 9mm x 9mm QFN64 package
IC3 IC4 = texas:TPS54240DGQR
J1 = EdM 2011:LUMBERG1502_01
L1 = inductors:LPS3008
L2 = WE-CBF:WE-CBF: SMD EMI Suppression Ferrite Beads WE-CBF - Excellent anti-EMI properties - Low DC-restistance - Impedances till 3000 ohms - Rated current up to 6 A -- Reliable Ni-Sn electrodes -- Perfect as data lined filter and for uncoupling of distribution voltage; MPN: 7427920; OC_FARNELL: 1635707; OC_NEWARK: 08P2358; PACKAGE: IND-0805; SUPPLIER: Wuerth Elektronik
L3 L4 = inductors:DR127: High Power Density, High Efficiency, Shielded Inductors Source: coiltronics_dr_series.pdf
LED1-LED4 = led:LED: LED OSRAM: - CHIPLED LG R971, LG N971, LY N971, LG Q971, LY Q971, LO R971, LY R971 LH N974, LH R974 LS Q976, LO Q976, LY Q976 LO Q996 - Hyper CHIPLED LW Q18S LB Q993, LB Q99A, LB R99A - SideLED LS A670, LO A670, LY A670, LG A670, LP A670 LB A673, LV A673, LT A673, LW A673 LH A674 LY A675 LS A676, LA A676, LO A676, LY A676, LW A676 LS A679, LY A679, LG A679 - Hyper Micro SIDELED® LS Y876, LA Y876, LO Y876, LY Y876 LT Y87S - SmartLED LW L88C, LW L88S LB L89C, LB L89S, LG L890 LS L89K, LO L89K, LY L89K LS L896, LA L896, LO L896, LY L896 - TOPLED LS T670, LO T670, LY T670, LG T670, LP T670 LSG T670, LSP T670, LSY T670, LOP T670, LYG T670 LG T671, LOG T671, LSG T671 LB T673, LV T673, LT T673, LW T673 LH T674 LS T676, LA T676, LO T676, LY T676, LB T676, LH T676, LSB T676, LW T676 LB T67C, LV T67C, LT T67C, LS T67K, LO T67K, LY T67K, LW E67C LS E67B, LA E67B, LO E67B, LY E67B, LB E67C, LV E67C, LT E67C LW T67C LS T679, LY T679, LG T679 LS T770, LO T770, LY T770, LG T770, LP T770 LB T773, LV T773, LT T773, LW T773 LH T774 LS E675, LA E675, LY E675, LS T675 LS T776, LA T776, LO T776, LY T776, LB T776 LHGB T686 LT T68C, LB T68C - Hyper Mini TOPLED® LB M676 - Mini TOPLED Santana® LG M470 LS M47K, LO M47K, LY M47K Source: http://www.osram.convergy.de LUXEON: - LUMILED® LXK2-PW12-R00, LXK2-PW12-S00, LXK2-PW14-U00, LXK2-PW14-V00 LXK2-PM12-R00, LXK2-PM12-S00, LXK2-PM14-U00 LXK2-PE12-Q00, LXK2-PE12-R00, LXK2-PE12-S00, LXK2-PE14-T00, LXK2-PE14-U00 LXK2-PB12-K00, LXK2-PB12-L00, LXK2-PB12-M00, LXK2-PB14-N00, LXK2-PB14-P00, LXK2-PB14-Q00 LXK2-PR12-L00, LXK2-PR12-M00, LXK2-PR14-Q00, LXK2-PR14-R00 LXK2-PD12-Q00, LXK2-PD12-R00, LXK2-PD12-S00 LXK2-PH12-R00, LXK2-PH12-S00 LXK2-PL12-P00, LXK2-PL12-Q00, LXK2-PL12-R00 Source: www.luxeon.com KINGBRIGHT: KA-3528ASYC Source: www.kingbright.com
LSP1 LSP2 = solpad:SE13: SOLDER PAD E1542, drill 1,3mm, distributor Buerklin, 07F815
PASS1 PASS2 = Passermarks:ROUND_1MM
Q1 = dcdc_BB3_V0:TRANSISTOR-FET_SI7113DN
Q2 Q3 = EdM 2011:CRYSTAL2P: Quarz Crystal
R1 R2 R6 R12-R23 R26 R28 R29 R31-R70 R73 R74 = resistor:R-EU_: RESISTOR, European symbol
R3-R5 R7-R11 R24 R25 R27 R30 = rcl:R-EU_: RESISTOR, European symbol
S1 = switch-tact:DTSM-6
SD1 = con-hirose:DM1AA-SF-PEJ
T1 T3 T6 T8 T10 T11 = SESA:ZETEX_NMOSSOT23: MOS FET
T2 T4 T7 T9 T12 T13 = SESA:ZETEX_PMOSSOT23: MOS FET
T5 = zetex:NMOSSOT23: MOS FET; OC_FARNELL: unknown; OC_NEWARK: unknown
X1 X9 X13-X15 = con-phoenix-381:MKDS1/2-3,81: MKDS 1/2-3,81 - Order No. 1727010 (RS-Online - 101-5384) Pitch: 3,81mm Number of terminals: 2 Rated Voltage: 160V Maximum load current/ cross section: 12A/1.5mm2-AWG16 Housing Interlocking: none Color: Green
X2 = con-hirose_1:DP11_8DP_2DS
X3 = con-phoenix-381:MKDS1/6-3,81: MKDS 1/6-3,81 - Order No. 1727052 Pitch: 3,81mm Number of terminals: 6 Rated Voltage: 160V Maximum load current/ cross section: 12A/1.5mm2-AWG16 Housing Interlocking: none Color: Green
X4 = con-phoenix-381:MKDS1/5-3,81: MKDS 1/5-3,81 - Order No. 1727049 Pitch: 3,81mm Number of terminals: 5 Rated Voltage: 160V Maximum load current/ cross section: 12A/1.5mm2-AWG16 Housing Interlocking: none Color: Green
X5 X7 = con-phoenix-381:MKDS1/3-3,81: MKDS 1/3-3,81 - Order No. 1727023 (RS-Online - 101-5390) Pitch: 3,81mm Number of terminals: 3 Rated Voltage: 160V Maximum load current/ cross section: 12A/1.5mm2-AWG16 Housing Interlocking: none Color: Green
X6 X10-X12 = con-phoenix-381:MKDS1/4-3,81: MKDS 1/4-3,81 - Order No. 1727036 Pitch: 3,81mm Number of terminals: 4 Rated Voltage: 160V Maximum load current/ cross section: 12A/1.5mm2-AWG16 Housing Interlocking: none Color: Green
X8 = con-phoenix-381:MKDS1/7-3,81: MKDS 1/7-3,81 - Order No. 1727065 Pitch: 3,81mm Number of terminals: 7 Rated Voltage: 160V Maximum load current/ cross section: 12A/1.5mm2-AWG16 Housing Interlocking: none Color: Green

## Net classes
1 GND: width 0.2 mm
2 VCC: width 0.25 mm